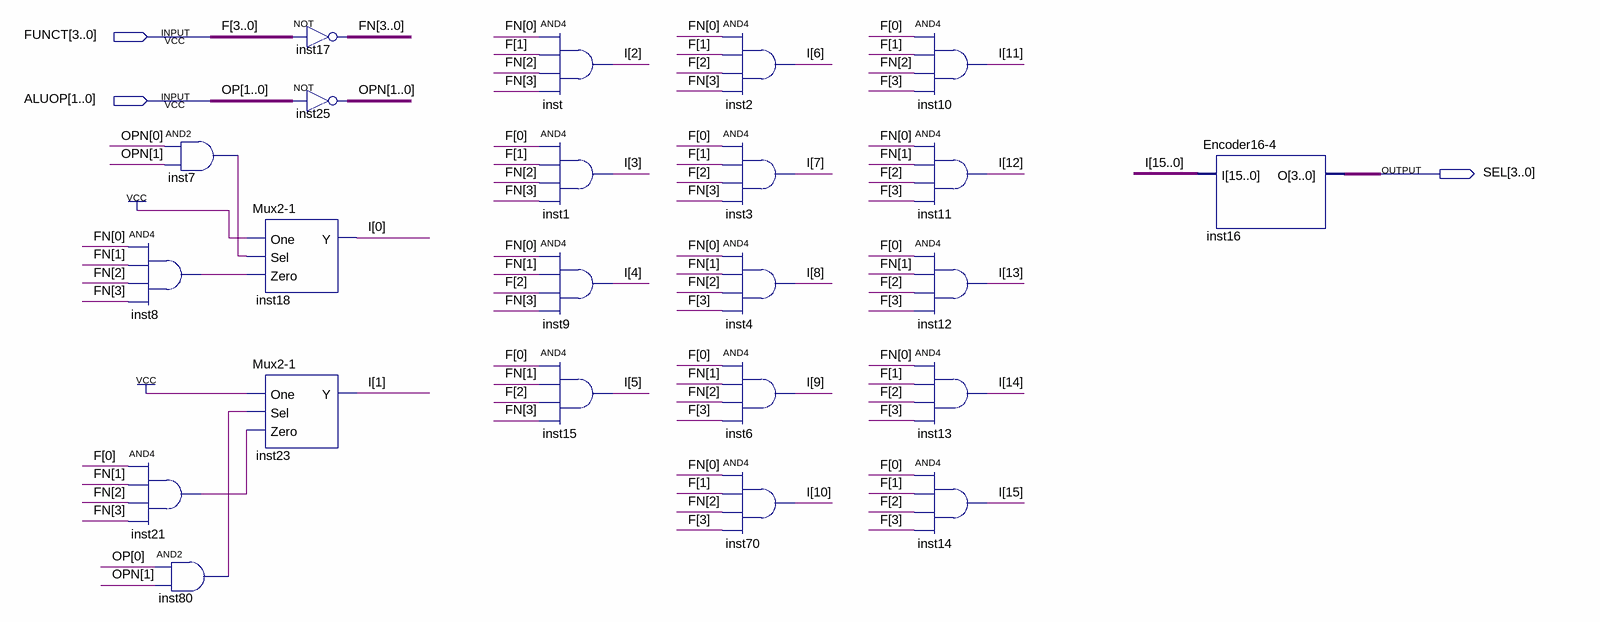
[diagram p0: schematic sheet]
// Quartus schematic ALUop.bdf as structural Verilog: 23 symbols, 3 pins
module ALUop (
  input  [3:0] FUNCT,
  input  [1:0] ALUOP,
  output [3:0] SEL
);

  wire inst7_out, inst8_out, inst21_out, inst80_out;
  wire [1:0] OPN;
  wire [3:0] FN;
  wire [15:0] I;

  and inst8 (inst8_out, FN[0], FN[1], FN[2], FN[3]);
  and inst21 (inst21_out, FUNCT[0], FN[1], FN[2], FN[3]);
  and inst7 (inst7_out, OPN[0], OPN[1]);
  and inst80 (inst80_out, ALUOP[0], OPN[1]);
  \Mux2-1  inst18 (.One(1'b1), .Sel(inst7_out), .Zero(inst8_out), .Y(I[0]));
  \Mux2-1  inst23 (.One(1'b1), .Sel(inst80_out), .Zero(inst21_out), .Y(I[1]));
  assign FN = ~FUNCT;  // NOT inst17, 4 bits wide
  assign OPN = ~ALUOP;  // NOT inst25, 2 bits wide
  and inst (I[2], FN[0], FUNCT[1], FN[2], FN[3]);
  and inst1 (I[3], FUNCT[0], FUNCT[1], FN[2], FN[3]);
  and inst9 (I[4], FN[0], FN[1], FUNCT[2], FN[3]);
  and inst15 (I[5], FUNCT[0], FN[1], FUNCT[2], FN[3]);
  and inst2 (I[6], FN[0], FUNCT[1], FUNCT[2], FN[3]);
  and inst3 (I[7], FUNCT[0], FUNCT[1], FUNCT[2], FN[3]);
  and inst4 (I[8], FN[0], FN[1], FN[2], FUNCT[3]);
  and inst6 (I[9], FUNCT[0], FN[1], FN[2], FUNCT[3]);
  and inst70 (I[10], FN[0], FUNCT[1], FN[2], FUNCT[3]);
  and inst10 (I[11], FUNCT[0], FUNCT[1], FN[2], FUNCT[3]);
  and inst11 (I[12], FN[0], FN[1], FUNCT[2], FUNCT[3]);
  and inst12 (I[13], FUNCT[0], FN[1], FUNCT[2], FUNCT[3]);
  and inst13 (I[14], FN[0], FUNCT[1], FUNCT[2], FUNCT[3]);
  and inst14 (I[15], FUNCT[0], FUNCT[1], FUNCT[2], FUNCT[3]);
  \Encoder16-4  inst16 (.I(I), .O(SEL));

  // Other names for the same wires on the sheet: F[3:0] = FUNCT; OP[1:0] = ALUOP
endmodule
